# EAGLE design strobocops (EAGLE 8.0.0)
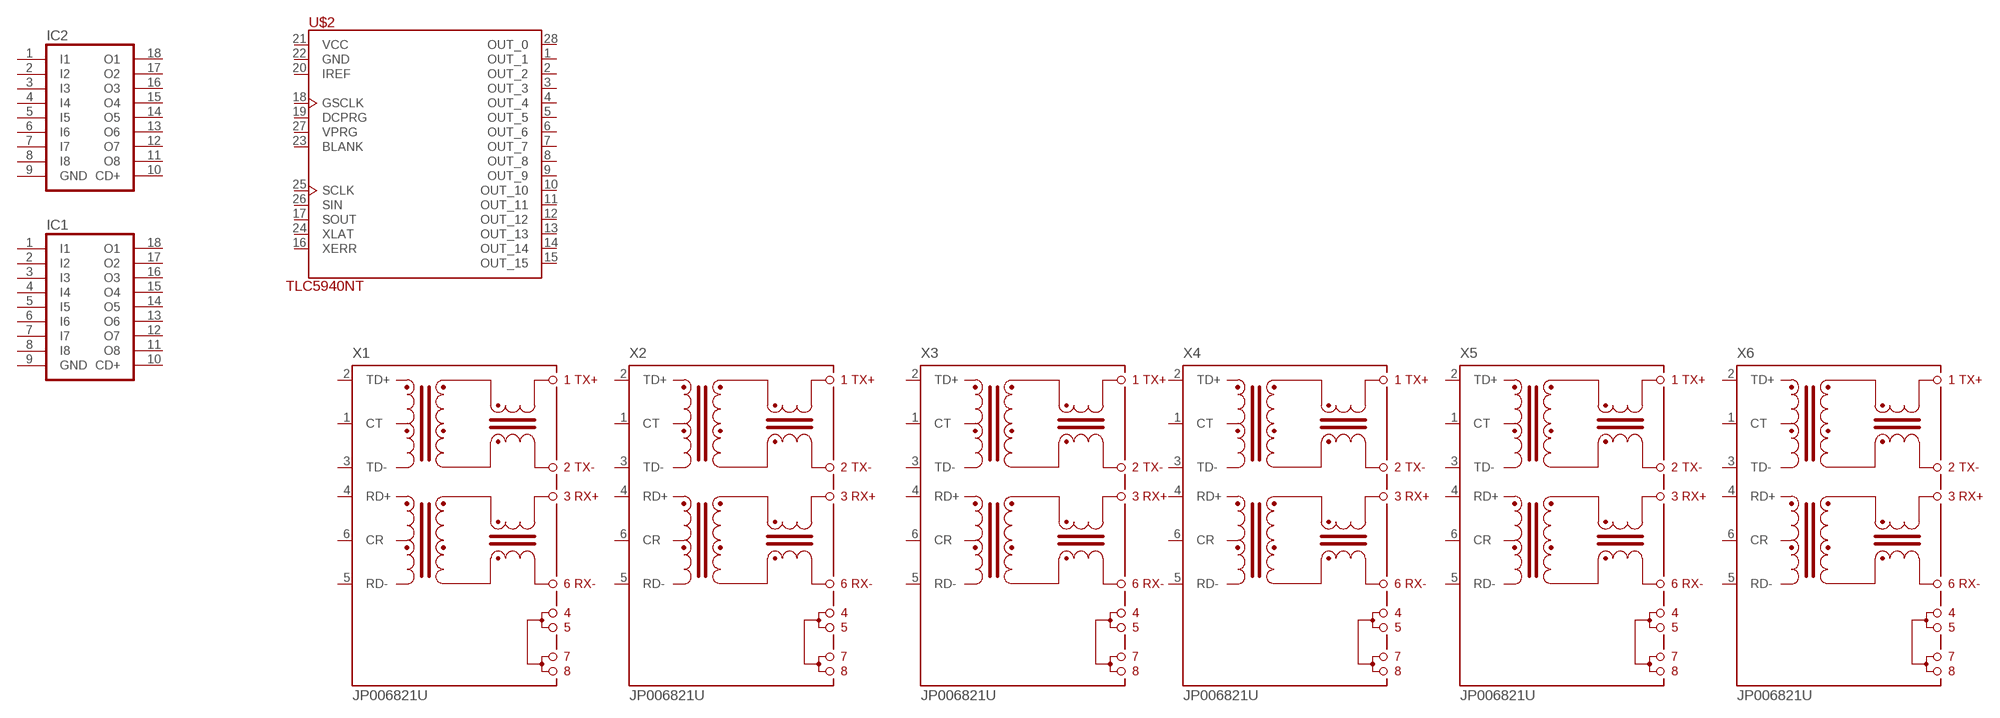
[diagram p0: schematic, sheet 1]

## Parts
IC1  ULN2803A  [DIL18]
IC2  ULN2803A  [DIL18]
U$2  TLC5940NT  [DIP-28]
X1  JP006821U  [JP]
X2  JP006821U  [JP]
X3  JP006821U  [JP]
X4  JP006821U  [JP]
X5  JP006821U  [JP]
X6  JP006821U  [JP]
Unconnected: IC1.1(I1) IC1.2(I2) IC1.3(I3) IC1.4(I4) IC1.5(I5) IC1.6(I6) IC1.7(I7) IC1.8(I8) IC1.10(CD+) IC1.11(O8) IC1.12(O7) IC1.13(O6) IC1.14(O5) IC1.15(O4) IC1.16(O3) IC1.17(O2) IC1.18(O1) IC2.1(I1) IC2.2(I2) IC2.3(I3) IC2.4(I4) IC2.5(I5) IC2.6(I6) IC2.7(I7) IC2.8(I8) IC2.10(CD+) IC2.11(O8) IC2.12(O7) IC2.13(O6) IC2.14(O5) IC2.15(O4) IC2.16(O3) IC2.17(O2) IC2.18(O1) U$2.1(OUT_1) U$2.2(OUT_2) U$2.3(OUT_3) U$2.4(OUT_4) U$2.5(OUT_5) U$2.6(OUT_6) U$2.7(OUT_7) U$2.8(OUT_8) U$2.9(OUT_9) U$2.10(OUT_10) U$2.11(OUT_11) U$2.12(OUT_12) U$2.13(OUT_13) U$2.14(OUT_14) U$2.15(OUT_15) U$2.16(XERR) U$2.17(SOUT) U$2.18(GSCLK) U$2.19(DCPRG) U$2.23(BLANK) U$2.24(XLAT) U$2.25(SCLK) U$2.26(SIN) U$2.27(VPRG) U$2.28(OUT_0) X1.1(CT) X1.2(TD+) X1.3(TD-) X1.4(RD+) X1.5(RD-) X1.6(CR) X2.1(CT) X2.2(TD+) X2.3(TD-) X2.4(RD+) X2.5(RD-) X2.6(CR) X3.1(CT) X3.2(TD+) X3.3(TD-) X3.4(RD+) X3.5(RD-) X3.6(CR) X4.1(CT) X4.2(TD+) X4.3(TD-) X4.4(RD+) X4.5(RD-) X4.6(CR) X5.1(CT) X5.2(TD+) X5.3(TD-) X5.4(RD+) X5.5(RD-) X5.6(CR) X6.1(CT) X6.2(TD+) X6.3(TD-) X6.4(RD+) X6.5(RD-) X6.6(CR)

## Power pins joined to a net without a drawn wire
GND: IC1.9(GND) IC2.9(GND) U$2.22(GND)
IREF: U$2.20(IREF)
VCC: U$2.21(VCC)

## Library data of the parts
IC1 IC2 = uln-udn:ULN2803A: DRIVER ARRAY
U$2 = tlc5940:TLC5940
X1-X6 = con-pulse:JP006821U: PULSEJACK (TM) 1x1 Tab-UP RJ45 10/100 Base-TX RJ45 1x1 Tab-UP with LEDs 8-pin (J1 series) and 6-pin (JP series) integrated magnetics connector, designed to support applications, such as ADSL modems, LAN-on-Motherboard, and Hub and Switches. Source: www.pulseeng.com .. PulseJack-J402.pdf; OC_FARNELL: unknown; OC_NEWARK: unknown

## Board
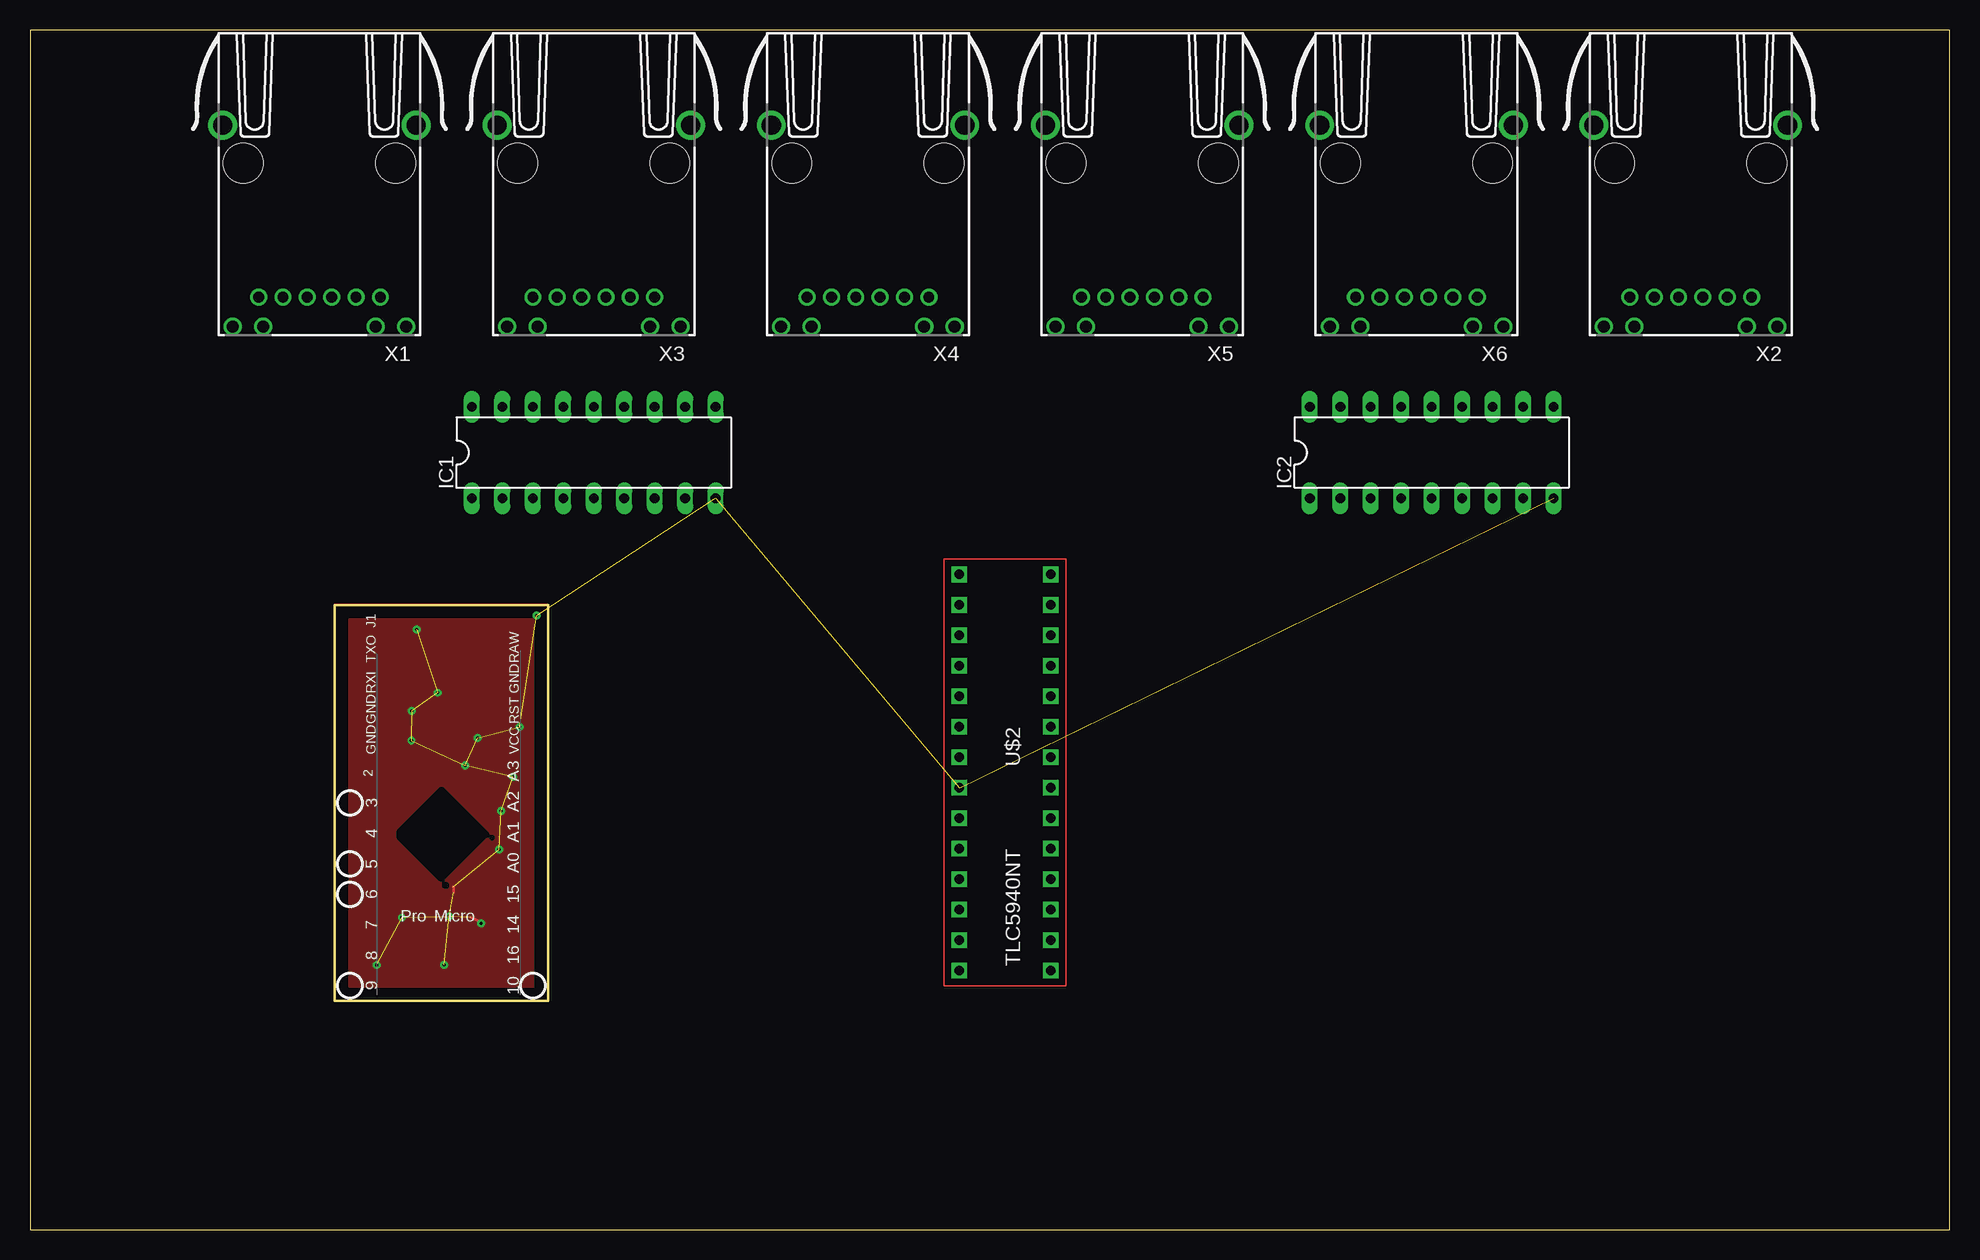
[diagram p1: board, top side]
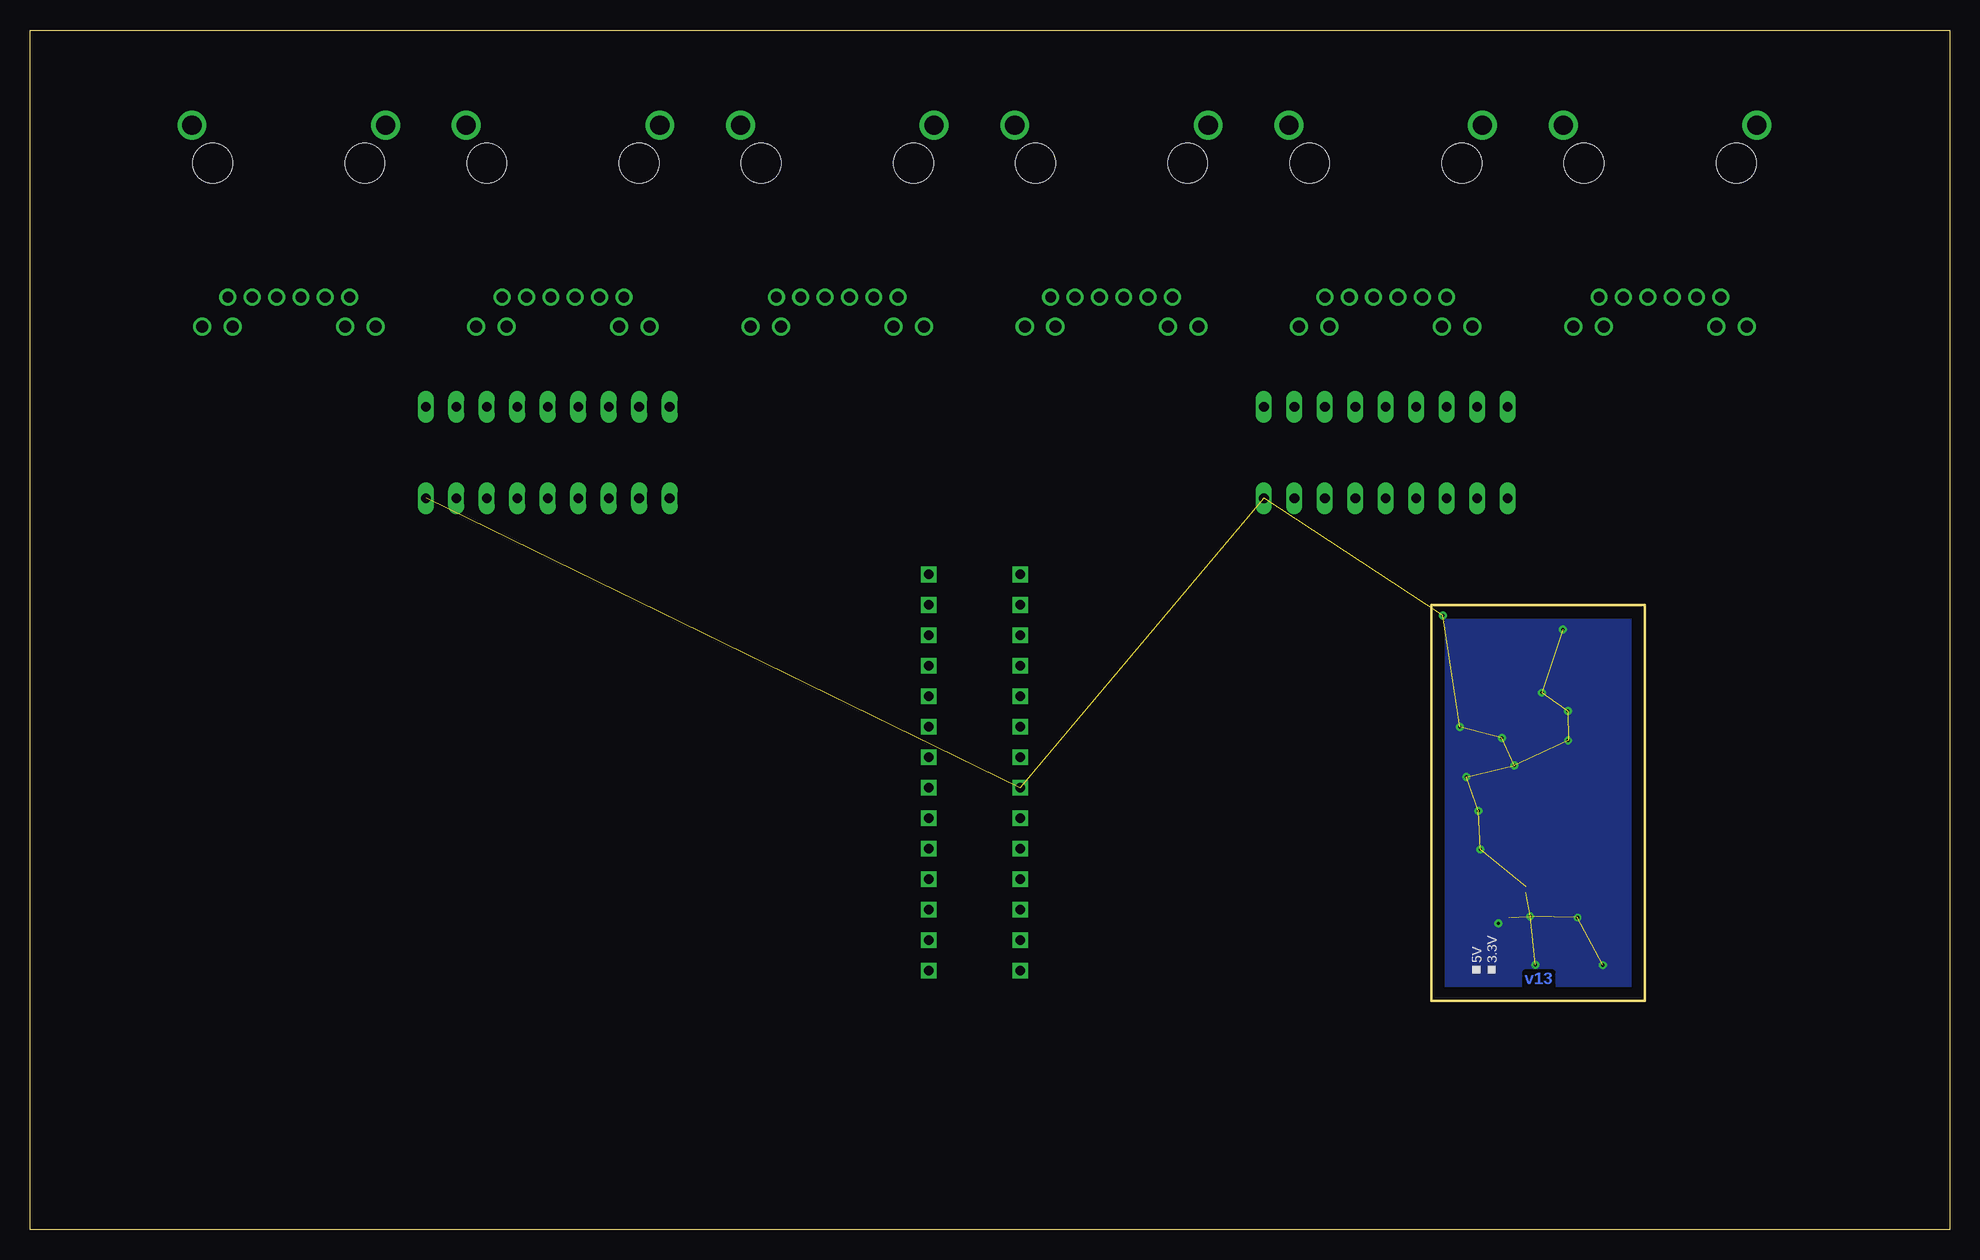
[diagram p2: board, bottom side, seen from below]

Size 160 x 100 mm. Coordinates in mm from the lower left corner, seen from the top.
Outline: 0,0 160,0 160,100 0,100 0,0
Outline: 25.4,52.07 25.4,19.05 43.18,19.05 43.18,52.07 25.4,52.07
Copper layers (1*16): Top 0.035mm / dielectric 1.5mm / Bottom 0.035mm
Design rules "default": minimum track width 10mil, minimum drill 24mil, track to track 8mil, track to pad 8mil, pad to pad 8mil, via to via 8mil, smd to smd 8mil, copper to edge 40mil, drill to drill 8mil, minimum pad ring 10mil, minimum via ring 8mil, stop-mask expansion 4mil, vias tented up to drill 0mil, thermal gap 10mil
tRestrict: area 34.5,28.6 to 34.7,28.8; area 38.5,32.6 to 38.5,32.7; area 30.9,29.3 to 38,36.6

### Footprints (pad centres in the part's own frame; a part is rotated, then mirrored left to right if it is on the bottom)
DIL18 = drill 0.813 long: 1 -10.16,-3.81; 2 -7.62,-3.81; 3 -5.08,-3.81; 4 -2.54,-3.81; 5 0,-3.81; 6 2.54,-3.81; 7 5.08,-3.81; 8 7.62,-3.81; 9 10.16,-3.81; 10 10.16,3.81; 11 7.62,3.81; 12 5.08,3.81; 13 2.54,3.81; 14 0,3.81; 15 -2.54,3.81; 16 -5.08,3.81; 17 -7.62,3.81; 18 -10.16,3.81
DIP-28 = drill 0.8 square: 1 -3.81,-1.27; 2 -3.81,-3.81; 3 -3.81,-6.35; 4 -3.81,-8.89; 5 -3.81,-11.43; 6 -3.81,-13.97; 7 -3.81,-16.51; 8 -3.81,-19.05; 9 -3.81,-21.59; 10 -3.81,-24.13; 11 -3.81,-26.67; 12 -3.81,-29.21; 13 -3.81,-31.75; 14 -3.81,-34.29; 15 3.81,-34.29; 16 3.81,-31.75; 17 3.81,-29.21; 18 3.81,-26.67; 19 3.81,-24.13; 20 3.81,-21.59; 21 3.81,-19.05; 22 3.81,-16.51; 23 3.81,-13.97; 24 3.81,-11.43; 25 3.81,-8.89; 26 3.81,-6.35; 27 3.81,-3.81; 28 3.81,-1.27
JP = drill 0.9 pad 1.3: 1 5.075,11.18; 2 3.045,11.18; 3 1.015,11.18; 4 -1.015,11.18; 5 -3.045,11.18; 6 -5.075,11.18 | drill 1 pad 1.4: 7 7.23,13.62; 8 4.69,13.62; 9 -4.69,13.62; 10 -7.23,13.62 | drill 1.6 pad 2.184: SH1 -8.065,-3.17; SH2 8.065,-3.17 | hole 3.3: 6.35,0; -6.35,0

### Placement (x,y rotation side)
IC1  46.99,64.77 0 top
IC2  116.84,64.77 0 top
U$2  81.28,20.32 180 top
X1  24.13,88.9 180 top
X2  138.43,88.9 180 top
X3  46.99,88.9 180 top
X4  69.85,88.9 180 top
X5  92.71,88.9 180 top
X6  115.57,88.9 180 top

### Tracks (layer width: path | path; a pad name or v marks a point on that pad's centre or on a via)
GND  (via drill 0.25)  (19 unrouted)
  Top 0.203: v39.11,31.67 v39.12,31.67 | 35.26,28.57 35.31,28.52 35.31,28.12 | 36.74,26.03 arc-21 v37.59,25.51
  other vias: 34.53,22.05 40.26,37.72 37.3,40.97 39.28,34.89 36.28,38.7 31.79,40.76 42.23,51.18 33.98,44.75 40.8,41.9 32.22,50.01 28.91,22.04 31,26 31.83,43.23 34.96,26.11
  pour Top (isolate 0.203): 25.4,52.07 43.18,52.07 43.18,19.05 25.4,19.05
  pour Bottom (isolate 0.203): 25.4,52.07 43.18,52.07 43.18,19.05 25.4,19.05

### Text on the board
Bottom: v13
tPlace: J1 | TXO | RAW | RXI | GND | GND | RST | GND | VCC | 2 | A3 | 3 | A2 | 4 | A1 | 5 | A0 | 6 | 15 | Pro | Micro | 7 | 14 | 8 | 16 | 9 | 10
bPlace: 3.3V | 5V
tValues: Valid combinations: | 3.3V Reg / 8MHz | 5V Reg / 16MHz | Mark back accordingly
tDocu: N. Seidle, revised by P. Lewis